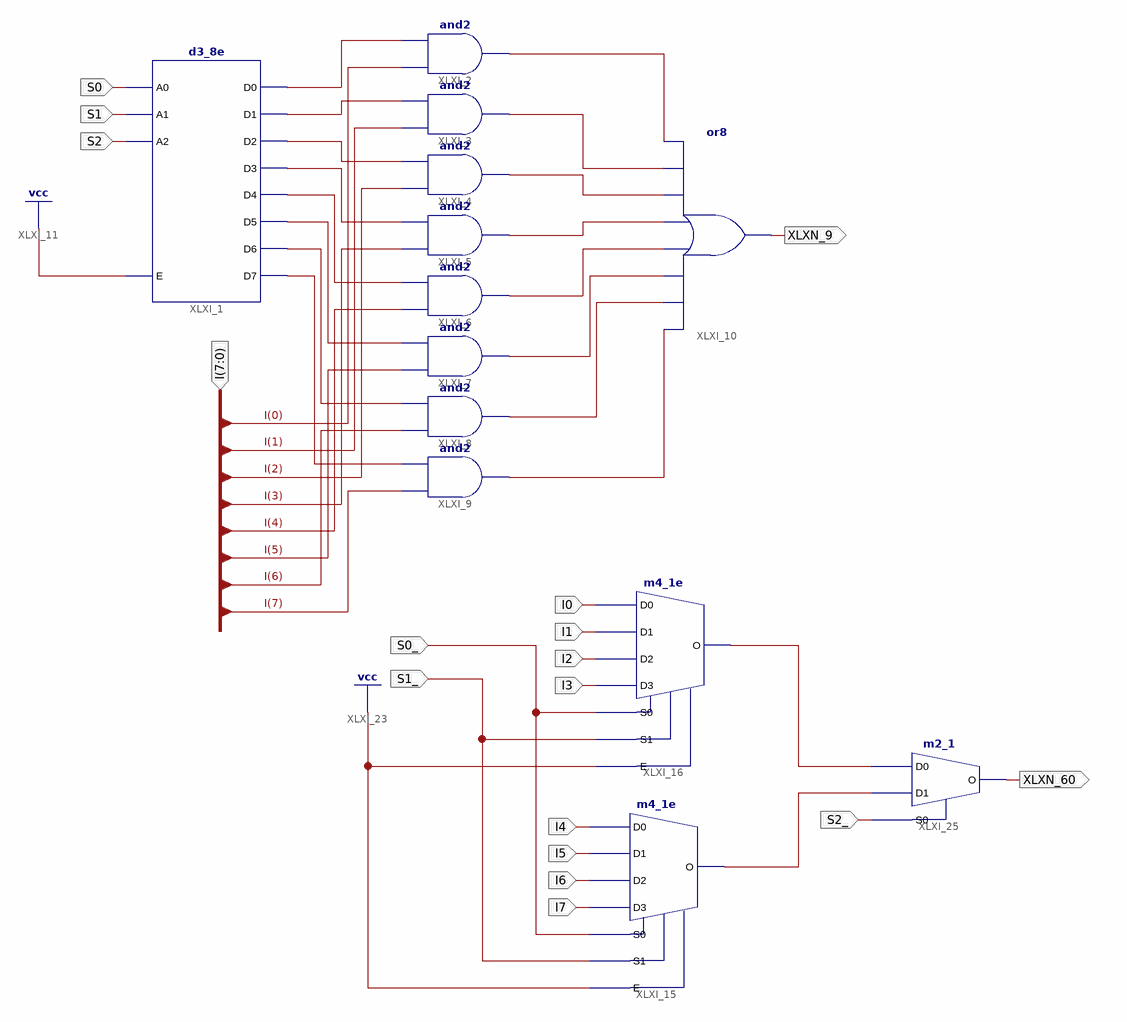
[diagram p0: schematic sheet 1]
// Xilinx ISE schematic C3_37.sch (kintex7) as structural Verilog: 13 symbols, 17 ports
module C3_37 (
  input  S0,
  input  S1,
  input  S2,
  input  [7:0] I,
  input  S0_,
  input  S1_,
  input  I0,
  input  I1,
  input  I2,
  input  I3,
  input  I4,
  input  I5,
  input  I6,
  input  I7,
  input  S2_,
  output XLXN_9,
  output XLXN_60
);

  wire XLXN_1, XLXN_2, XLXN_3, XLXN_4, XLXN_5, XLXN_6, XLXN_7, XLXN_8, XLXN_14, XLXN_15, XLXN_16, XLXN_17,
       XLXN_18, XLXN_19, XLXN_20, XLXN_21, XLXN_57, XLXN_58;

  d3_8e XLXI_1 (
    .A0(S0), .A1(S1), .A2(S2), .E(1'b1), .D0(XLXN_14), .D1(XLXN_15), .D2(XLXN_16), .D3(XLXN_17),
    .D4(XLXN_18), .D5(XLXN_19), .D6(XLXN_20), .D7(XLXN_21));
  and XLXI_2 (XLXN_1, I[0], XLXN_14);
  and XLXI_3 (XLXN_2, I[1], XLXN_15);
  and XLXI_4 (XLXN_3, I[2], XLXN_16);
  and XLXI_5 (XLXN_4, I[3], XLXN_17);
  and XLXI_6 (XLXN_5, I[4], XLXN_18);
  and XLXI_7 (XLXN_6, I[5], XLXN_19);
  and XLXI_8 (XLXN_7, I[6], XLXN_20);
  and XLXI_9 (XLXN_8, I[7], XLXN_21);
  or XLXI_10 (XLXN_9, XLXN_8, XLXN_7, XLXN_6, XLXN_5, XLXN_4, XLXN_3, XLXN_2, XLXN_1);
  m4_1e XLXI_16 (.D0(I0), .D1(I1), .D2(I2), .D3(I3), .E(1'b1), .S0(S0_), .S1(S1_), .O(XLXN_57));
  m4_1e XLXI_15 (.D0(I4), .D1(I5), .D2(I6), .D3(I7), .E(1'b1), .S0(S0_), .S1(S1_), .O(XLXN_58));
  m2_1 XLXI_25 (.D0(XLXN_57), .D1(XLXN_58), .S0(S2_), .O(XLXN_60));
endmodule
